# Altium schematic sheet sheet.SchDoc
size A; SheetNumber: 1; SheetTotal: 1
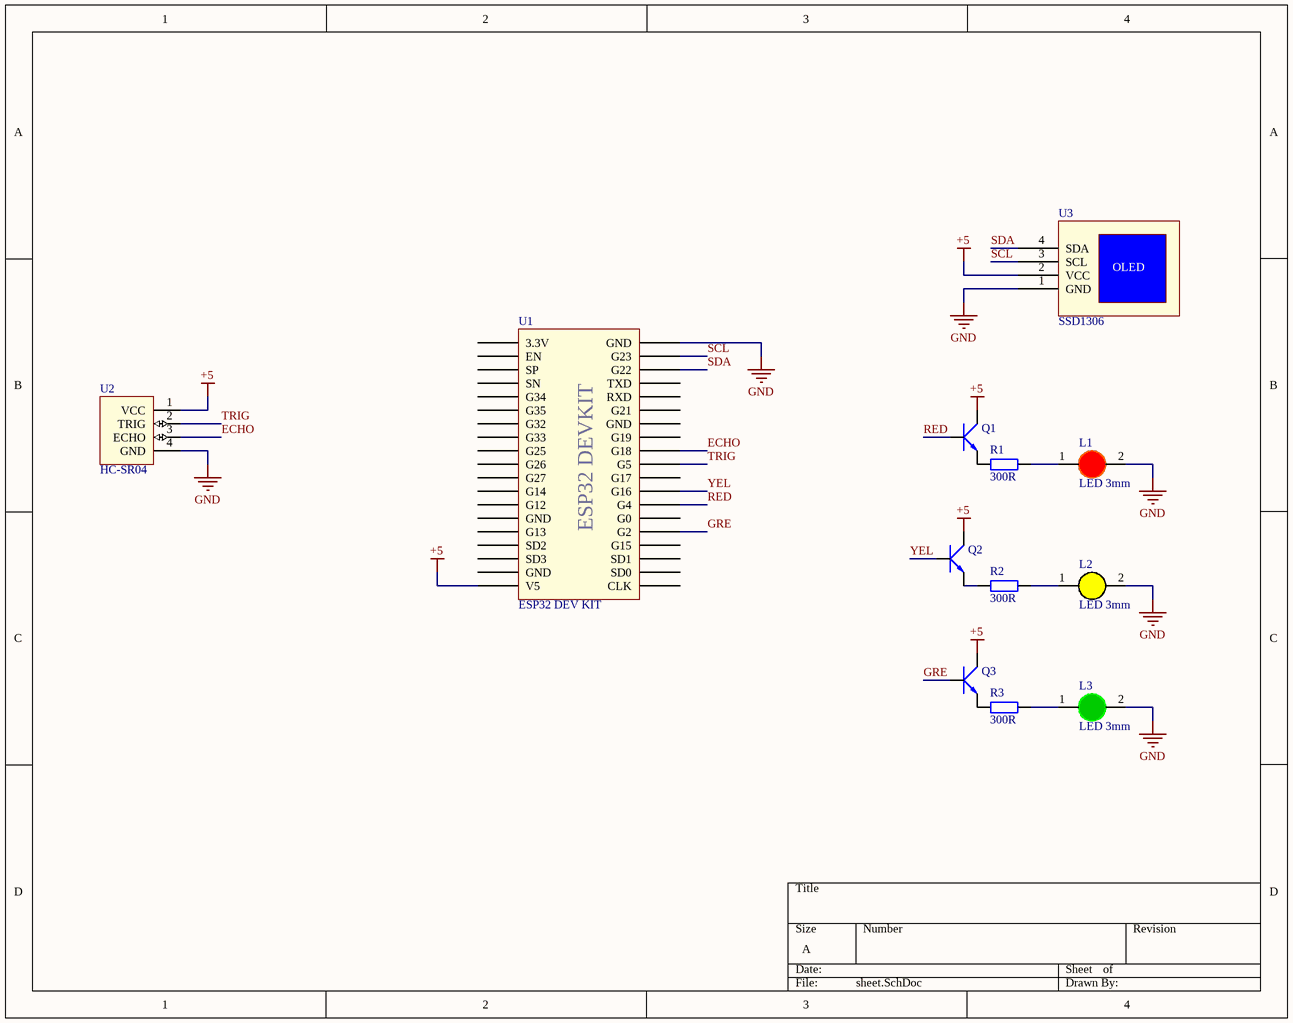
[diagram p0: sheet.SchDoc]

## Parts
L1  LED 3mm  [LED-3MM-RED]
L2  LED 3mm  [LED-3MM-YELLOW]
L3  LED 3mm  [LED-3MM-GREEN]
Q1  ?  [TO92]  (value not drawn)
Q2  ?  [TO92]  (value not drawn)
Q3  ?  [TO92]  (value not drawn)
R1  300R  [tro vach 1/4w]
R2  300R  [tro vach 1/4w]
R3  300R  [tro vach 1/4w]
U1  ESP32 DEV KIT  [ESP32 DEVKIT]
U2  HC-SR04  [HC-SR04_Footprint]
U3  SSD1306  [OLED-SSD1306_Footprint]

## Nets
+5: Q1.3(C) Q2.3(C) Q3.3(C) U1.19(V5) U2.1(VCC) U3.2(VCC)
GND: L1.2(K) L2.2(K) L3.2(K) U1.38(GND) U2.4(GND) U3.1(GND)
ECHO: U1.30(G18) U2.3(ECHO)
GRE: Q3.2(B) U1.24(G2)
RED: Q1.2(B) U1.26(G4)
SCL: U1.37(G23) U3.3(SCL)
SDA: U1.36(G22) U3.4(SDA)
TRIG: U1.29(G5) U2.2(TRIG)
YEL: Q2.2(B) U1.27(G16)
NetL1_1: L1.1(A) R1.2
NetL2_1: L2.1(A) R2.2
NetL3_1: L3.1(A) R3.2
NetQ1_1: Q1.1(E) R1.1
NetQ2_1: Q2.1(E) R2.1
NetQ3_1: Q3.1(E) R3.1

Not connected (* = marked no-connect by the designer): U1 1(3.3V) 2(EN) 3(SP) 4(SN) 5(G34) 6(G35) 7(G32) 8(G33) 9(G25) 10(G26) 11(G27) 12(G14) 13(G12) 14(GND) 15(G13) 16(SD2) 17(SD3) 18(GND) 20(CLK) 21(SD0) 22(SD1) 23(G15) 25(G0) 28(G17) 31(G19) 32(GND) 33(G21) 34(RXD) 35(TXD)

## Notes on the sheet
- (in symbol ESP32 DEV KIT) ESP32 DEVKIT
- (in symbol OLED-SSD1306) OLED

## Library data of the parts
L1 = LED 3mm Do: Cắm; Don_Vi: Con; Ma_Hang: MH003892; Ten_Linh_Kien: Led 3MM Phủ Đỏ (10c); Ghi_Chu: *; Kieu_Chan: *; Chung_Loai: Cắm
L2 = LED 3mm Vang: Cắm; Don_Vi: Con; Ma_Hang: MH003893; Ten_Linh_Kien: Led 3MM Phủ Vàng (10c); Ghi_Chu: *; Kieu_Chan: *; Chung_Loai: Cắm
L3 = LED 3mm Xanh La: Cắm; Don_Vi: Con; Ma_Hang: MH001054; Ten_Linh_Kien: Led 3MM Phủ Xanh (10c); Ghi_Chu: *; Kieu_Chan: *; Chung_Loai: Cắm
Q1-Q3 = Trans 2N3904: NPN transistor EBC; Value: C9014
R1-R3 = Tro Vach 1/4W 5% 300R: Cắm; So_Chan: 2; Ten_Linh_Kien: Trở Vạch 1/4w 5% 300R; Ma_Hang: MH007309; Don_Vi: Con; Chung_Loai: Cắm; Kieu_Chan: *
U3 = OLED-SSD1306